# Altium project KeyBoard.PrjPcb
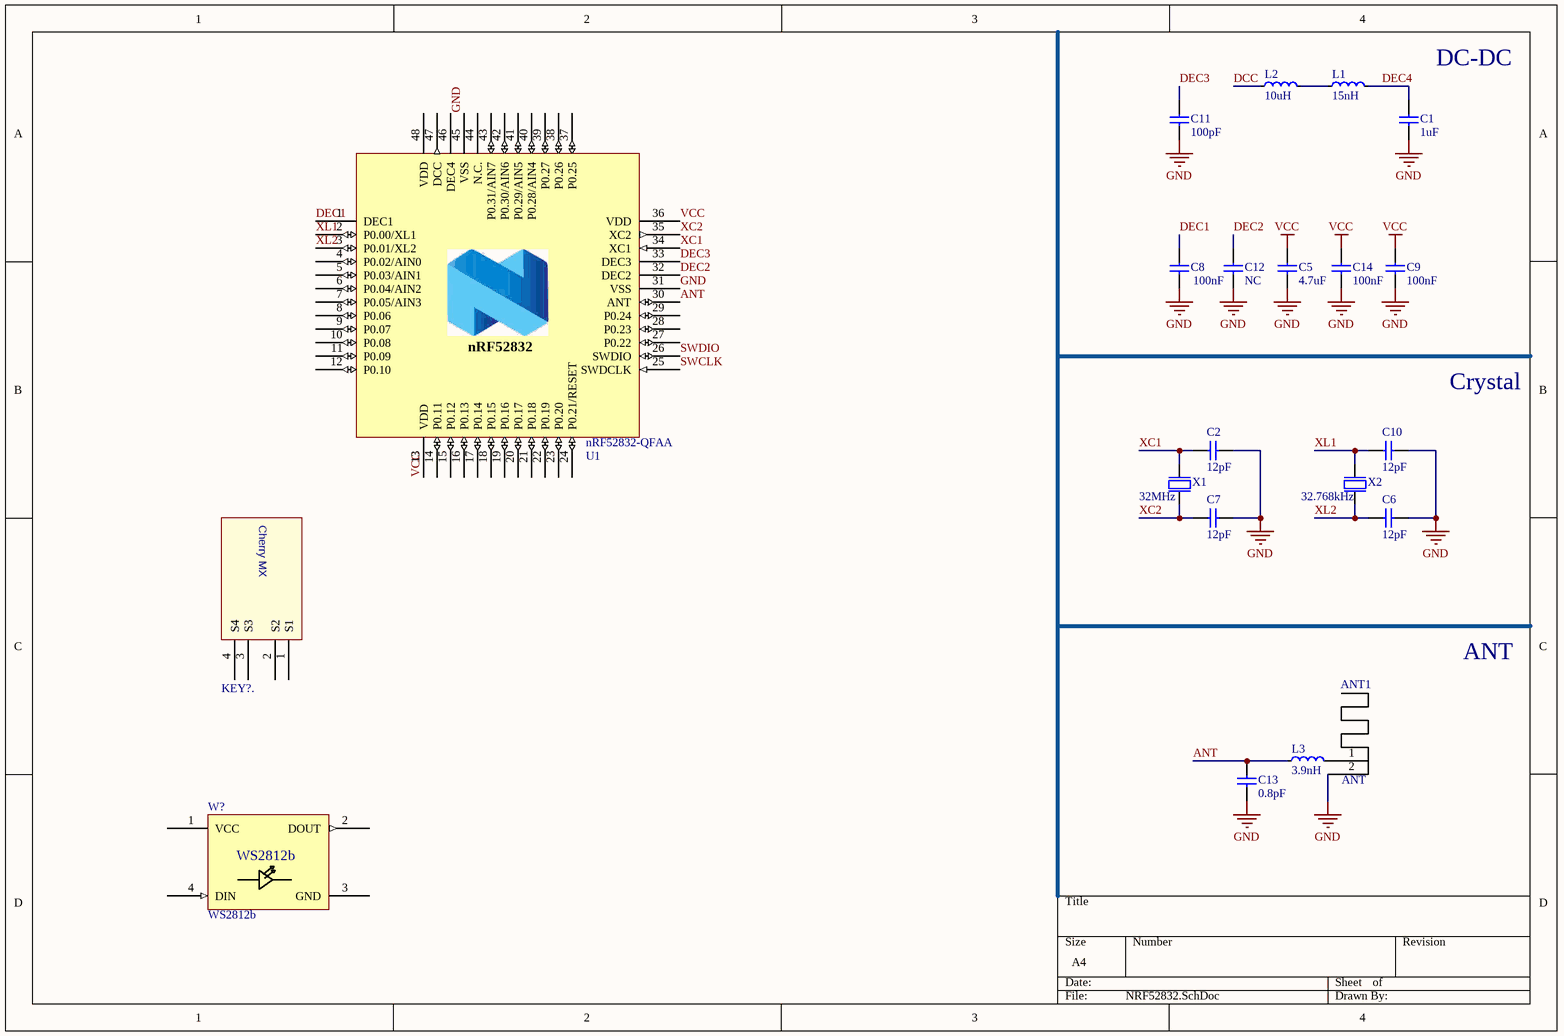
[diagram p0: NRF52832.SchDoc]
2 sheets, 44 parts. Net scope: global (net labels, ports and power ports of the same name join across sheets).
Sheets:
  NRF52832.SchDoc
  Jlink OB.SchDoc

## Sheet NRF52832.SchDoc
size A4

### Parts
ANT1  ANT
C1  1uF  [C 0402_L]
C2  12pF  [C 0402_L]
C5  4.7uF  [C 0402_L]
C6  12pF  [C 0402_L]
C7  12pF  [C 0402_L]
C8  100nF  [C 0402_L]
C9  100nF  [C 0402_L]
C10  12pF  [C 0402_L]
C11  100pF  [C 0402_L]
C12  NC  [C 0402_L]
C13  0.8pF  [C 0402_L]
C14  100nF  [C 0402_L]
KEY?.  CHERRY_MX  [CherryMX]  (value not drawn)
L1  15nH  [R 0402_L]
L2  10uH  [L 0603]
L3  3.9nH  [R 0402_L]
U1  nRF52832-QFAA  [QFN40P600X600X90-48N]
W?  WS2812b  [DIOC500500X250_NR]
X1  32MHz  [OSC 3225-4P]
X2  32.768kHz  [XTAL_3215]

### Nets
GND: ANT1.2 C1.1 C2.2 C5.1 C6.1 C7.2 C8.1 C9.1 C10.1 C11.1 C12.1 C13.1 C14.1 U1.31(VSS) U1.45(VSS) U1.49(GND) X1.2(GND) X1.4(GND)
VCC: C5.2 C9.2 C14.2 U1.13(VDD) U1.36(VDD)
ANT: C13.2 L3.1 U1.30(ANT)
DCC: L2.1
DEC1: C8.2 U1.1(DEC1)
DEC2: C12.2 U1.32(DEC2)
DEC3: C11.2 U1.33(DEC3)
DEC4: C1.2 L1.2
SWCLK: U1.25(SWDCLK)
SWDIO: U1.26(SWDIO)
XC1: C2.1 U1.34(XC1) X1.3(out)
XC2: C7.1 U1.35(XC2) X1.1(inp)
XL1: C10.2 U1.2(P0.00/XL1) X2.1(inp)
XL2: C6.2 U1.3(P0.01/XL2) X2.2(out)
NetANT1_1: ANT1.1 L3.2
NetL1_1: L1.1 L2.2

Not connected (* = marked no-connect by the designer): KEY?. 1(S1) 2(S2) 3(S3) 4(S4); U1 4(P0.02/AIN0) 5(P0.03/AIN1) 6(P0.04/AIN2) 7(P0.05/AIN3) 8(P0.06) 9(P0.07) 10(P0.08) 11(P0.09) 12(P0.10) 14(P0.11) 15(P0.12) 16(P0.13) 17(P0.14) 18(P0.15) 19(P0.16) 20(P0.17) 21(P0.18) 22(P0.19) 23(P0.20) 24(P0.21/RESET) 27(P0.22) 28(P0.23) 29(P0.24) 37(P0.25) 38(P0.26) 39(P0.27) 40(P0.28/AIN4) 41(P0.29/AIN5) 42(P0.30/AIN6) 43(P0.31/AIN7) 44(N.C.) 46(DEC4) 47(DCC) 48(VDD); W? 1(VCC) 2(DOUT) 3(GND) 4(DIN)

### Notes on the sheet
- DC-DC
- Crystal
- ANT
- (in symbol CHERRY_MX) Cherry MX
- (in symbol nRF52832_QFAA) nRF52832

### Library data of the parts
C1 C2 C5-C14 = CAP: Capacitor, NP0, ?.1pF; Part Number: C0402-1.2p; Value: 1.2pF; Note: 50V; Artikkelnr Noca: 20029157; Artikkelnr Simpro: N.A.; Manufacturer: *; Manufacturer Part Number: *; Datasheet: *; LatestRevisionDate: 2011-05-11; Pin Count: 2; Publisher: Nordic Semiconductor; Published: 2009-05-08; Supplier: *; Supplier part number: *; 2nd source Supplier: *; 2nd source part number: *; Footprint Doc: 0402
L1-L3 = IND: Inductor, 80mA, ?0%; Part Number: L0603-10?; Manufacturer: Taiyo Yuden; Manufacturer Part Number: LBMF1608T100K; 2nd source part number: 178-6105; Value: 10礖; Note: LBMF1608T100K 10礖 80mA 0603; Artikkelnr Noca: 33029314; Artikkelnr Simpro: N.A.; Datasheet: http://www.yuden.co.jp/ut/product/pdf/elb2_e.pdf; LatestRevisionDate: 2012-09-19; Pin Count: 2; Publisher: Nordic Semiconductor; Published: 2010-02-24; Supplier: Digi-Key; Supplier part number: 587-1714-1-ND; 2nd source Supplier: Farnell; Footprint Doc: 0603
U1 = nRF52832_QFAA: Multi-protocol Bluetooth Low Energy and 2.4GHz proprietary system-on-chip; Manufacturer: Nordic Semiconductor; Artikkelnr Noca: N.A.; Part Number: nRF52832-QFAA; Manufacturer Part Number: nRF52832-QFAA; Datasheet: *; LatestRevisionDate: 2014-11-26; Pin Count: 48; Publisher: Nordic Semiconductor; Published: 2014-11-26; Value: nRF52832-QFAA; Note: *; Supplier: Nordic Semiconductor; Supplier part number: *; 2nd source Supplier: *; 2nd source part number: *; Footprint Doc: QFN-48; Artikkelnr Simpro: N.A.
W? = WS2812b_Sumasta: The Infamous Chinese Chainable RGB LED
X1 = XTAL_4-pin_grounded: XTAL SMD 2016, 32MHz, Cl=8pF, Tol: ?0ppm, Stab: ?0ppm; Part Number: XTAL_SMD2016_32MHz_8pF_Epson; Manufacturer: Epson Toyocom; Manufacturer Part Number: Q22FA12800025; Note: XTAL SMD 32.000MHz; Artikkelnr Noca: N.A.; Datasheet: http://www.epsondevice.com/docs/qd/en/DownloadServlet?id=ID000449; LatestRevisionDate: 2014-11-27; Pin Count: 4; Publisher: Nordic Semiconductor; Published: 2012-03-09; Value: 32MHz; Supplier: Farnell; Supplier part number: 171-2806; 2nd source Supplier: *; 2nd source part number: *; Footprint Doc: XTAL_2016; Artikkelnr Simpro: N.A.
X2 = XTAL_2-pin: EPSON TOYOCOM - FC-135 32.768KHZ ?0PPM,9.0PF - CRYSTAL, SM, WATCH; Part Number: XTAL_FC-135 32.768k; 2nd source part number: 127-8037; Note: XTAL SMD 32.768kHz, 3215; Artikkelnr Noca: 22019091; Artikkelnr Simpro: N.A.; Manufacturer: Epson Toyocom; Manufacturer Part Number: FC-135 32.768KHZ ?0PPM,9.0PF; Datasheet: http://www.farnell.com/datasheets/57480.pdf; LatestRevisionDate: 2014-03-27; Pin Count: 2; Publisher: Nordic Semiconductor; Published: 2010-10-18; Value: 32.768kHz; Supplier: Digi-Key; Supplier part number: FC-135 32.7680KA-AC-ND; 2nd source Supplier: Farnell; Footprint Doc: XTAL_3215

## Sheet Jlink OB.SchDoc
size A
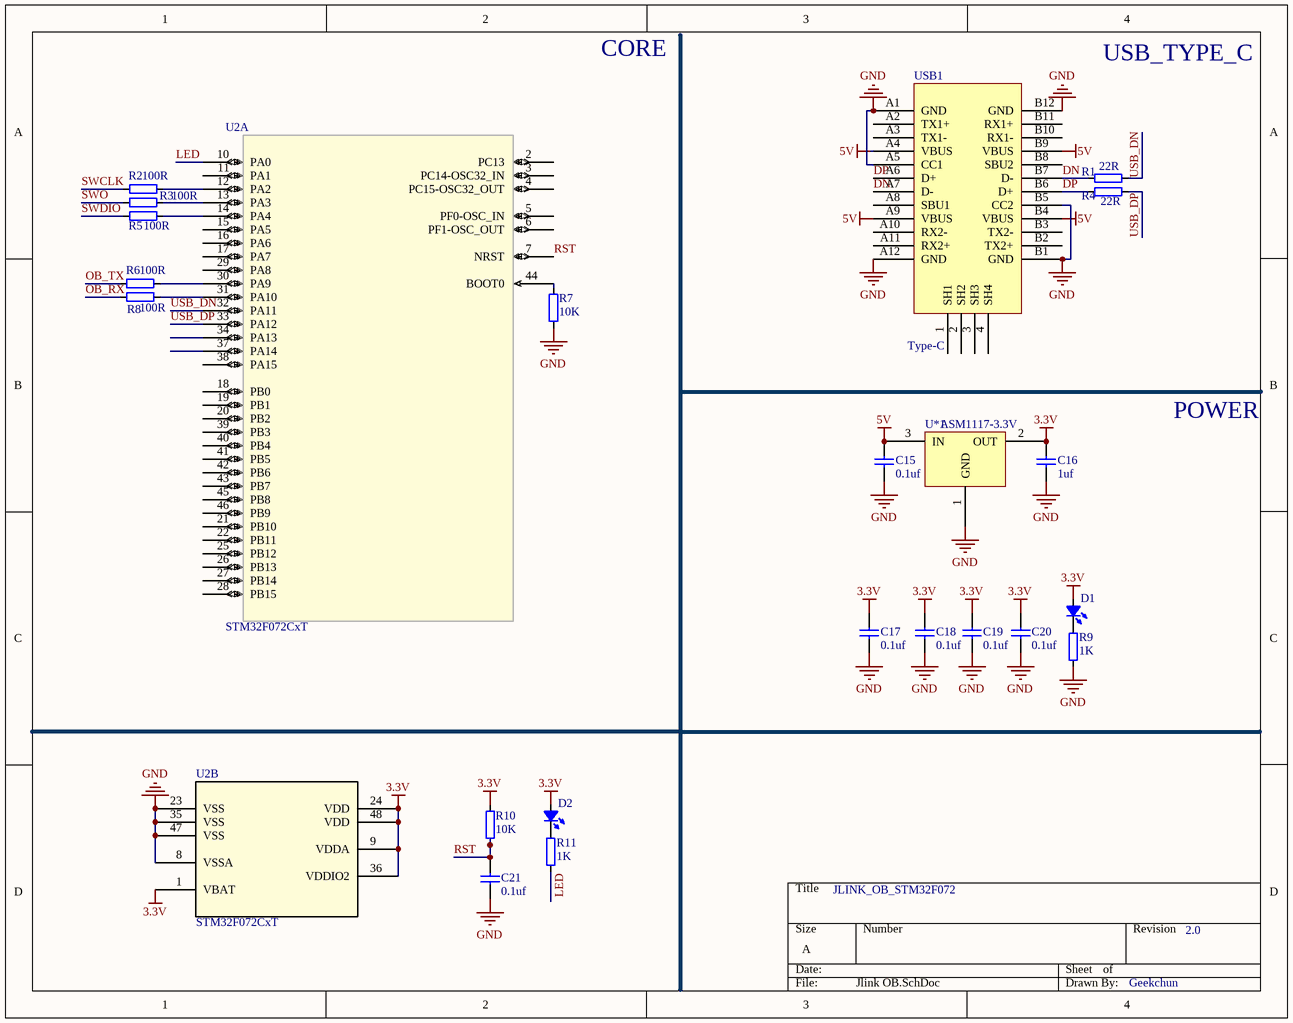
[diagram p1: Jlink OB.SchDoc]

### Parts
C15  0.1uf  [C 0603_L]
C16  1uf  [C 0603_L]
C17  0.1uf  [C 0603_L]
C18  0.1uf  [C 0603_L]
C19  0.1uf  [C 0603_L]
C20  0.1uf  [C 0603_L]
C21  0.1uf  [C 0603_L]
D1  LED_0603  [LED_0603_BLUE]  (value not drawn)
D2  LED_0603  [LED_0603_GREEN]  (value not drawn)
R1  22R  [R 0603_L]
R2  100R  [R 0603_L]
R3  100R  [R 0603_L]
R4  22R  [R 0603_L]
R5  100R  [R 0603_L]
R6  100R  [R 0603_L]
R7  10K  [R 0603_L]
R8  100R  [R 0603_L]
R9  1K  [R 0603_L]
R10  10K  [R 0603_L]
R11  1K  [R 0603_L]
U2  STM32F072CxT  [LQFP_P0.5_48]  (parts A,B of 2)
U*1  ASM1117-3.3V  [SOT-89]
USB1  Type-C  [PCBComponent_1]

### Nets
3.3V: C16.2 C17.2 C18.2 C19.2 C20.2 D1.1(A) D2.1(A) R10.2 U2.1(VBAT) U2.9(VDDA) U2.24(VDD) U2.36(VDDIO2) U2.48(VDD) U*1.2(OUT)
5V: C15.2 U*1.3(IN) USB1.A4(VBUS) USB1.A9(VBUS) USB1.B4(VBUS) USB1.B9(VBUS)
GND: C15.1 C16.1 C17.1 C18.1 C19.1 C20.1 C21.1 R7.2 R9.1 U2.8(VSSA) U2.23(VSS) U2.35(VSS) U2.47(VSS) U*1.1(GND) USB1.A1(GND) USB1.A5(CC1) USB1.A12(GND) USB1.B1(GND) USB1.B5(CC2) USB1.B12(GND)
DN: R1.1 USB1.A7(D-) USB1.B7(D-)
DP: R4.1 USB1.A6(D+) USB1.B6(D+)
LED: R11.1 U2.10(PA0)
OB_RX: R8.1
OB_TX: R6.1
RST: C21.2 R10.1 U2.7(NRST)
SWCLK: R2.1
SWDIO: R5.1
SWO: R3.1
USB_DN: R1.2 U2.32(PA11)
USB_DP: R4.2 U2.33(PA12)
NetD1_2: D1.2(K) R9.2
NetD2_2: D2.2(K) R11.2
NetR2_2: R2.2 U2.12(PA2)
NetR3_2: R3.2 U2.13(PA3)
NetR5_2: R5.2 U2.14(PA4)
NetR6_2: R6.2 U2.30(PA9)
NetR7_1: R7.1 U2.44(BOOT0)
NetR8_2: R8.2 U2.31(PA10)

Not connected (* = marked no-connect by the designer): U2 2(PC13) 3(PC14-OSC32_IN) 4(PC15-OSC32_OUT) 5(PF0-OSC_IN) 6(PF1-OSC_OUT) 11(PA1) 15(PA5) 16(PA6) 17(PA7) 18(PB0) 19(PB1) 20(PB2) 21(PB10) 22(PB11) 25(PB12) 26(PB13) 27(PB14) 28(PB15) 29(PA8) 34(PA13) 37(PA14) 38(PA15) 39(PB3) 40(PB4) 41(PB5) 42(PB6) 43(PB7) 45(PB8) 46(PB9); USB1 1(SH1) 2(SH2) 3(SH3) 4(SH4) A2(TX1+) A3(TX1-) A8(SBU1) A10(RX2-) A11(RX2+) B2(TX2+) B3(TX2-) B8(SBU2) B10(RX1-) B11(RX1+)

### Notes on the sheet
- CORE
- USB_TYPE_C
- POWER
- JLINK_OB_STM32F072
- 2.0
- Geekchun

### Library data of the parts
C15-C21 = CAP: as C1 on sheet NRF52832; Manufacturer: *; Manufacturer Part Number: *; Datasheet: *; LatestRevisionDate: 2011-05-11; Pin Count: 2; Publisher: Nordic Semiconductor; Published: 2009-05-08; Supplier: *; Supplier part number: *; 2nd source Supplier: *; 2nd source part number: *; Footprint Doc: 0402
D1 D2 = LED_0603: LED
R1-R11 = RES
U2 = STM32F072CxT: Imported; Vendor: STMicroelectronics; C: Copyright (C) 2016 Accelerated Designs. All rights reserved; Copyright: Copyright (C) 2016 Accelerated Designs. All rights reserved; Manufacturer_Part_Number: stm32f072cxt; RefDes: RefDes; Type: Type; Value: Value
U*1 = ASM1117-3.3V: 三端可调或固定电压3.3V

## Nets that join several sheets
GND: NRF52832 (18 pins), Jlink OB (20 pins)
SWCLK: NRF52832 (U1.25), Jlink OB (R2.1)
SWDIO: NRF52832 (U1.26), Jlink OB (R5.1)